# EAGLE design tube-tester (EAGLE 6.6.0)
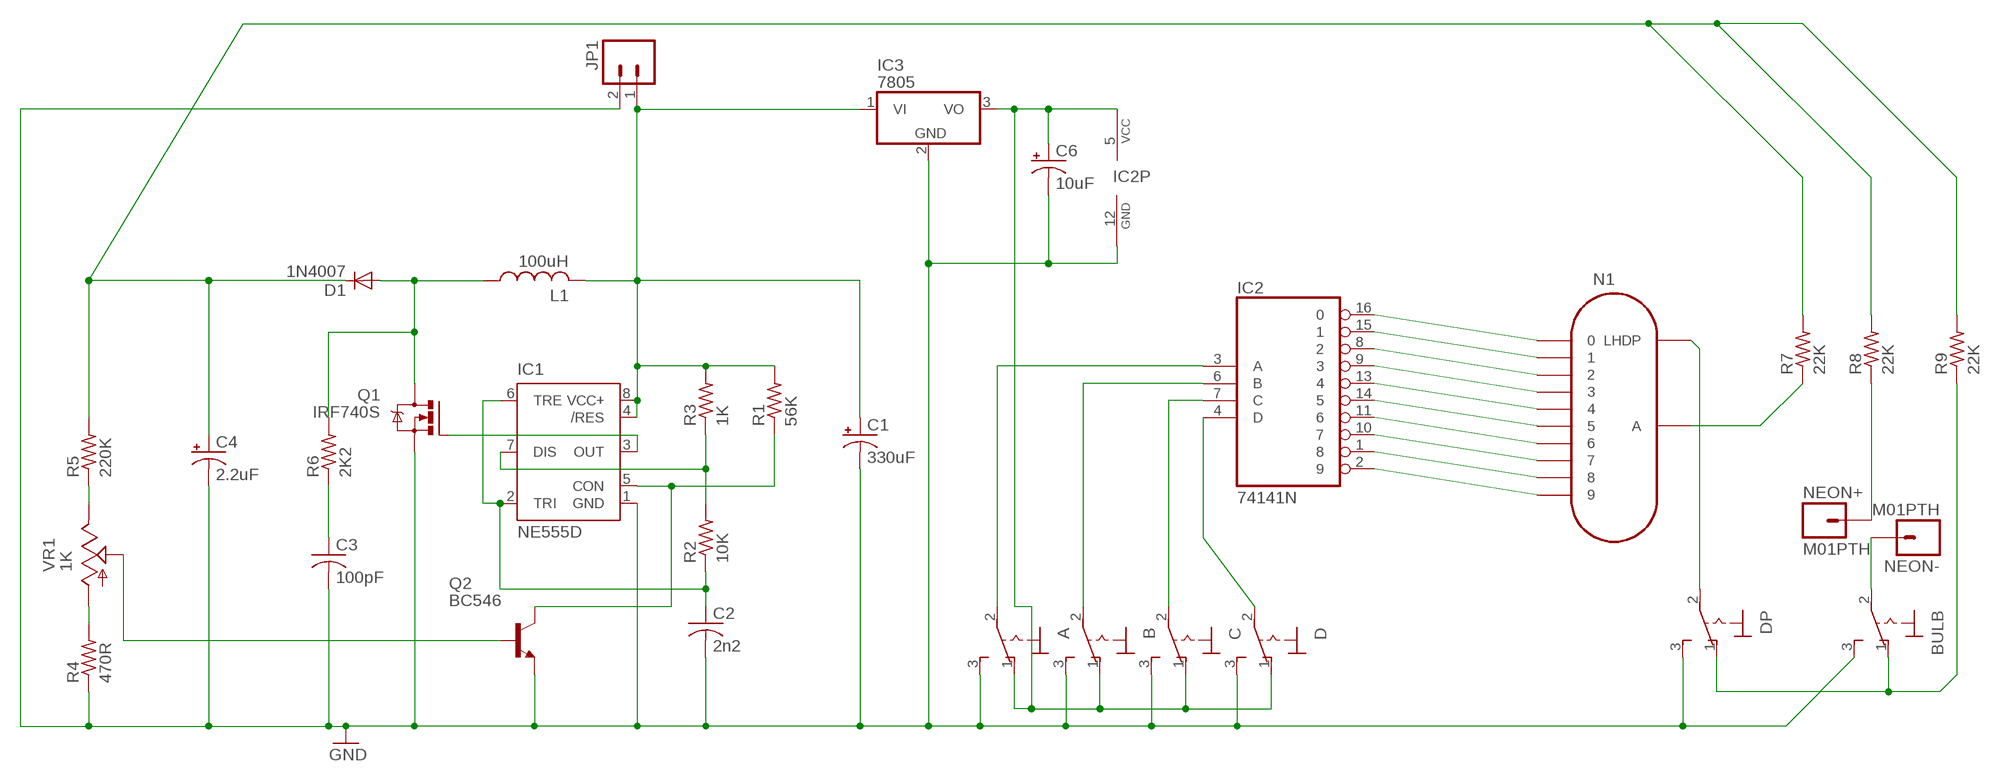
[diagram p0: schematic, sheet 1]

## Parts
A  320-916  [320-916]
B  320-916  [320-916]
BULB  320-916  [320-916]
C  320-916  [320-916]
C1  330uF  CAPACITOR_POLE5-10.5  [E5-10,5]
C2  2n2  CAPACITORC1206K  [C1206K]
C3  100pF  CAPACITORC1206K  [C1206K]
C4  2.2uF  CAPACITOR_POLE3.5-8  [E3,5-8]
C6  10uF  CAPACITOR_POLE2-5  [E2-5]
D  320-916  [320-916]
D1  1N4007  DIODESMA  [SMA-DIODE]
DP  320-916  [320-916]
IC1  NE555D  [SO08]
IC2  74141N  [DIL16]
IC3  7805  7805T  [TO220H]
JP1  M023.5MM  [SCREWTERMINAL-3.5MM-2]
L1  100uH  INDUCTOR0207/10  [0207/10]
N1  IN-12B  [IN-12]
NEON+  M01PTH  [1X01]
NEON-  M01PTH  [1X01]
Q1  IRF740S  [TO263]
Q2  BC546  BC546A  [TO92-EBC]
R1  56K  RESISTORR1206  [R1206]
R2  10K  RESISTORR1206  [R1206]
R3  1K  RESISTORR1206  [R1206]
R4  470R  RESISTOR0207/10  [0207/10]
R5  220K  RESISTOR0207/10  [0207/10]
R6  2K2  RESISTORR1206  [R1206]
R7  22K  RESISTOR0207/10  [0207/10]
R8  22K  RESISTOR0207/10  [0207/10]
R9  22K  RESISTOR0207/10  [0207/10]
VR1  1K  TRIM_POTCA6V  [CA6V]

## Nets
GND: A.3(S) B.3(S) BULB.3(S) C1.- C2.2 C3.2 C4.- C6.- C.3(S) D.3(S) DP.3(S) IC1.1(GND) IC2.12(GND) IC3.2(GND) JP1.2 Q1.2(S) Q2.E R4.1
N$1: IC1.3(OUT) Q1.1(G)
N$2: C3.1 R6.1
N$3: IC1.5(CON) Q2.C R1.1
N$4: IC1.7(DIS) R2.2 R3.1
N$5: C2.1 IC1.2(TRI) IC1.6(TRE) R2.1
N$6: D1.A L1.1 Q1.3(D) R6.2
N$7: C4.+ D1.C R5.2 R7.2 R8.2 R9.2
N$8: R5.1 VR1.E
N$9: R4.2 VR1.A
N$10: Q2.B VR1.S
N$11: IC2.15 N1.1
N$12: IC2.8 N1.2
N$13: IC2.9 N1.3
N$14: IC2.13 N1.4
N$15: IC2.14 N1.5
N$16: IC2.11 N1.6
N$17: IC2.10 N1.7
N$18: IC2.1 N1.8
N$19: IC2.2 N1.9
N$20: IC2.16 N1.0
N$21: N1.A R7.1
N$22: A.2(P) IC2.3(A)
N$23: B.2(P) IC2.6(B)
N$24: C.2(P) IC2.7(C)
N$25: D.2(P) IC2.4(D)
N$26: C1.+ IC1.4(/RES) IC1.8(VCC+) IC3.1(VI) JP1.1 L1.2 R1.2 R3.2
N$27: NEON+.1 R8.1
N$28: BULB.2(P) NEON-.1
N$29: A.1(O) B.1(O) C6.+ C.1(O) D.1(O) IC2.5(VCC) IC3.3(VO)
N$30: DP.2(P) N1.LHDP
N$32: BULB.1(O) DP.1(O) R9.1

## Library data of the parts
A B BULB C D DP = iStivi - Button-Switch:320-916: TOGGLE SWITCH distributor RS Components
C1 C4 C6 = iStivi - RCLD:CAPACITOR_POL: POLARIZED CAPACITOR, American symbol
C2 C3 = iStivi - RCLD:CAPACITOR: CAPACITOR, American symbol
D1 = iStivi - RCLD:DIODE: Diode These are standard reverse protection diodes and small signal diodes.
IC1 = iStivi - ICs:NE555: Timer General purpose bipolar Timer
IC2 = iStivi - ICs:74*141: Nixie Driver BCD to decimal decoder/driver
IC3 = iStivi - Transistor-FET-reg:78*: Positive VOLTAGE REGULATOR Source: http://cache.national.com/ds/LM/LM78L05.pdf http://www.fairchildsemi.com/ds/LM/LM7805.pdf
JP1 = iStivi - Header-Connector:M02: Header 2 Standard 2-pin 0.1" header. Use with straight break away headers (SKU : PRT-00116), right angle break away headers (PRT-00553), swiss pins (PRT-00743), machine pins (PRT-00117), and female headers (PRT-00115). Molex polarized connector foot print use with SKU : PRT-08233 with associated crimp pins and housings.
L1 = iStivi - RCLD:INDUCTOR: INDUCTOR
N1 = iStivi - Tubes:IN-12B: IN-12B: medium numeric topview nixie tube
NEON+ NEON- = iStivi - Header-Connector:M01: Header 1 Standard 1-pin 0.1" header. Use with straight break away headers (SKU : PRT-00116), right angle break away headers (PRT-00553), swiss pins (PRT-00743), machine pins (PRT-00117), and female headers (PRT-00115).
Q1 = iStivi - Transistor-FET:IRF740: N-CHANNEL MOS FET 400V MOSFET
Q2 = iStivi - Transistor-FET-reg:BC546*: NPN Transistor
R1-R9 = iStivi - RCLD:RESISTOR: RESISTOR
VR1 = iStivi - RCLD:TRIM_POT: POTENTIOMETER

## Board
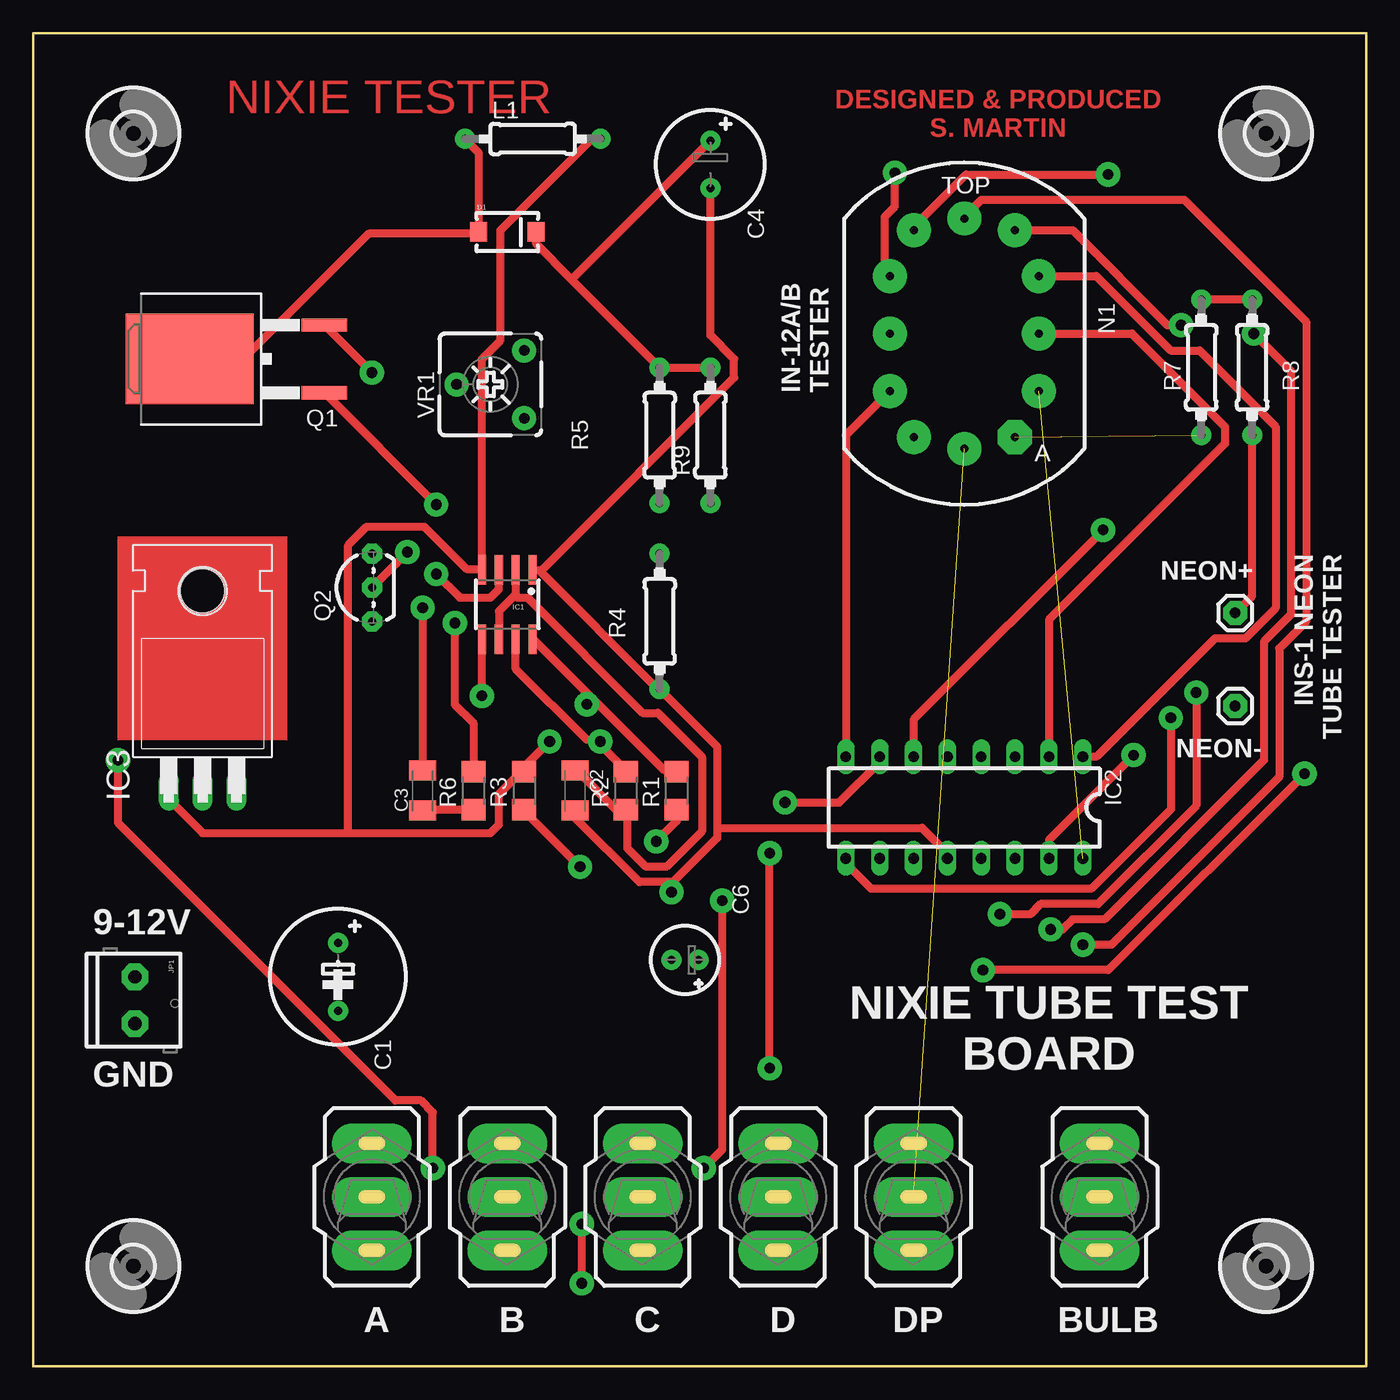
[diagram p1: board, top side]
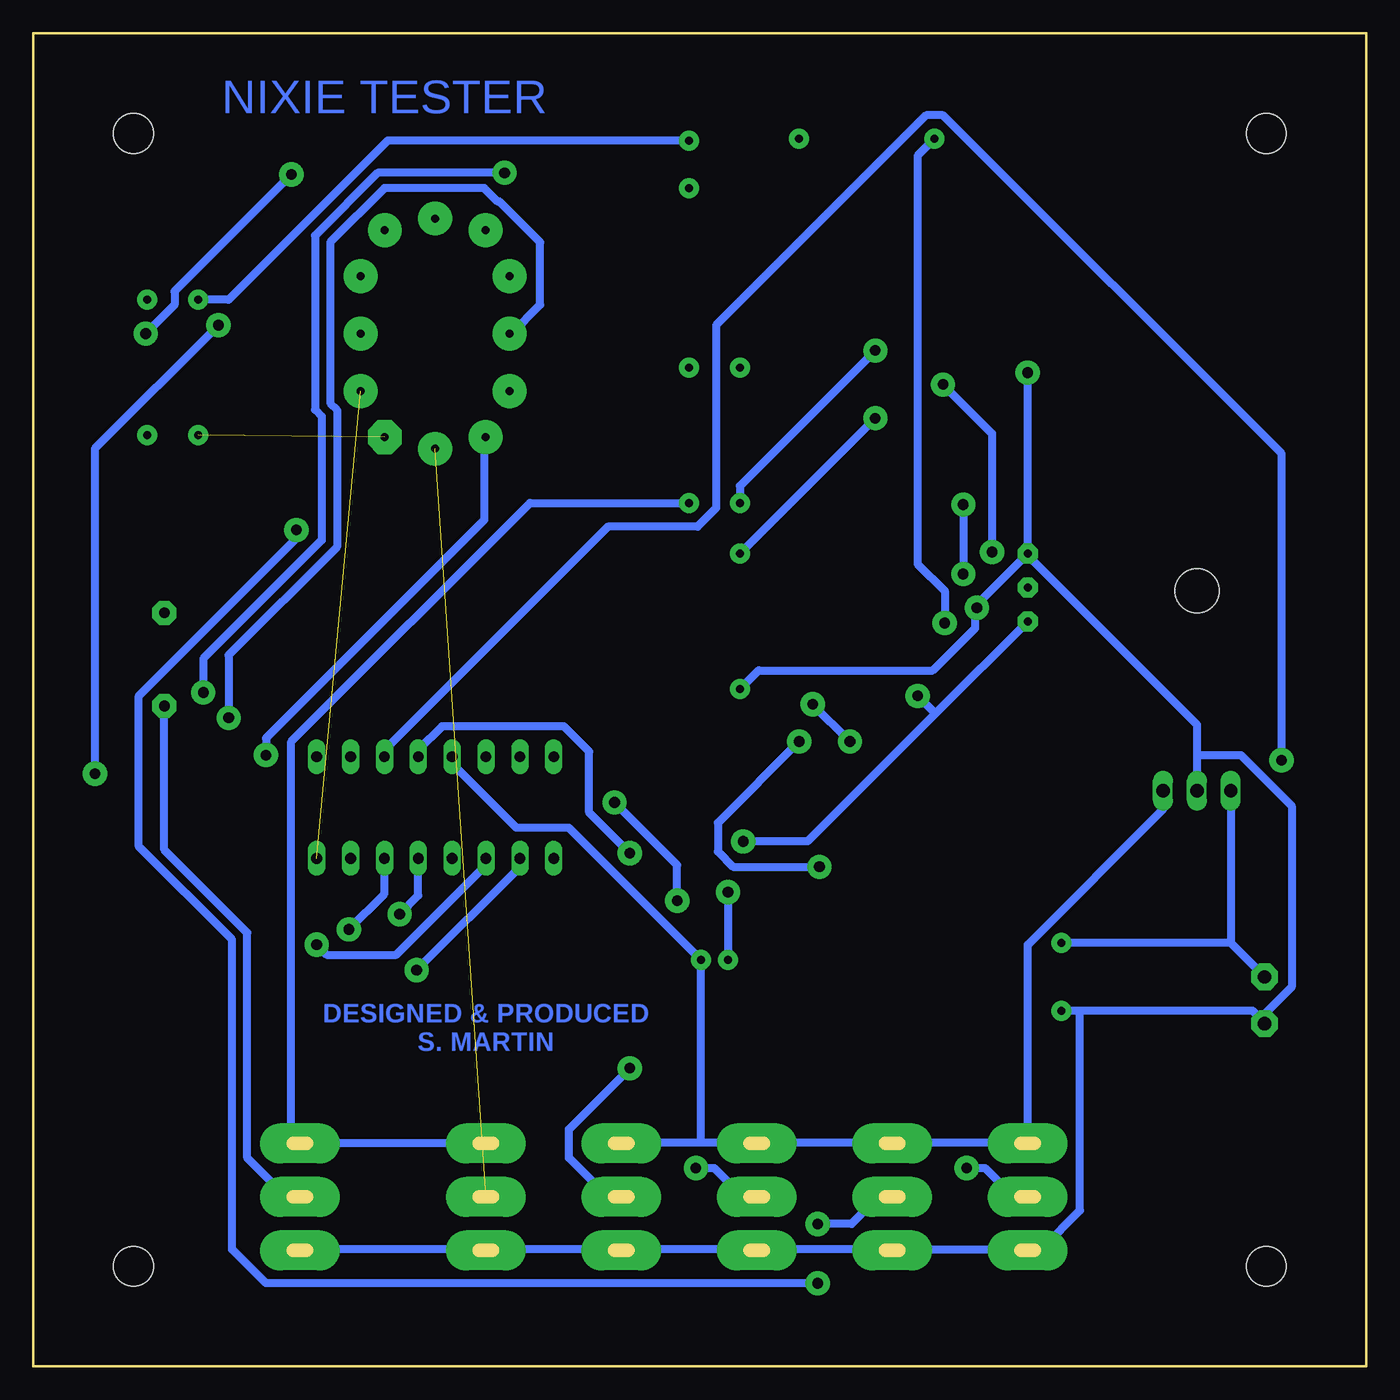
[diagram p2: board, bottom side, seen from below]

Size 100 x 100 mm. Coordinates in mm from the lower left corner, seen from the top.
Outline: 0,0 0,100 100,100 100,0 0,0
Copper layers (1*16): Top 0.035mm / dielectric 1.5mm / Bottom 0.035mm
Design rules "iStivi-0.8mm via-16mil-track *": minimum track width 24mil, minimum drill 0.8mm, track to track 20mil, track to pad 24mil, pad to pad 10mil, via to via 30mil, smd to smd 10mil, copper to edge 40mil, drill to drill 8mil, minimum pad ring 10mil, minimum via ring 20mil, stop-mask expansion 0mil, vias tented up to drill 0mil, thermal gap 12mil
tRestrict: area 5.1,24.8 to 10.2,30.5; area 21.9,30.8 to 23.8,32.7; area 21.9,25.7 to 23.8,27.6

### Footprints (pad centres in the part's own frame; a part is rotated, then mirrored left to right if it is on the bottom)
320-916 = drill 0.8 pad 3 long: 1 0,4.013; 2 0,0; 3 0,-4.013
E5-10,5 = drill 0.6 pad 1.5: + -2.54,0; - 2.54,0
C1206K = smd 1.5 x 2: 1 -1.5,0; 2 1.5,0
E3,5-8 = drill 0.6 pad 1.5: + -1.778,0; - 1.778,0
E2-5 = drill 0.6 pad 1.5: + -1.016,0; - 1.016,0
SMA-DIODE = smd 1.27 x 1.47: A -2.15,0; C 2.15,0
SO08 = smd 0.61 x 2.21: 1 -1.905,-2.616; 2 -0.635,-2.616; 3 0.635,-2.616; 4 1.905,-2.616; 5 1.905,2.616; 6 0.635,2.616; 7 -0.635,2.616; 8 -1.905,2.616
DIL16 = drill 0.8 long: 1 -8.89,-3.81; 2 -6.35,-3.81; 3 -3.81,-3.81; 4 -1.27,-3.81; 5 1.27,-3.81; 6 3.81,-3.81; 7 6.35,-3.81; 8 8.89,-3.81; 9 8.89,3.81; 10 6.35,3.81; 11 3.81,3.81; 12 1.27,3.81; 13 -1.27,3.81; 14 -3.81,3.81; 15 -6.35,3.81; 16 -8.89,3.81
TO220H = drill 1 long: 1 -2.54,-10.16; 2 0,-10.16; 3 2.54,-10.16 | hole 3.302: 0,4.826
SCREWTERMINAL-3.5MM-2 = drill 1 pad 2 octagon: 1 0,0; 2 3.5,0
0207/10 = drill 0.6 pad 1.5: 1 -5.08,0; 2 5.08,0
IN-12 = drill 0.6 pad 2.54: 0 5.59,-4.32; 1 -3.78,-7.766; 2 -5.59,-4.32; 3 -5.59,0; 4 -5.59,4.32; 5 -3.78,7.766; 6 0,8.64; 7 3.78,7.766; 8 5.59,4.32; 9 5.59,0; LHDP 0,-8.64 | drill 0.6 pad 2.54 octagon: A 3.78,-7.766
1X01 = drill 0.8 pad 1.8 octagon: 1 0,0
TO263 = smd 1 x 3.4: 1 -2.54,-6.6; 2 2.54,-6.6 | smd 6.8 x 9.6: 3 0,3.5
TO92-EBC = drill 0.6 pad 1.5 octagon: B 0,-1.27; C -2.54,-1.27; E 2.54,-1.27
R1206 = smd 1.6 x 1.803: 1 -1.422,0; 2 1.422,0
3,0 = hole 3: 0,0
CA6V = drill 0.8 pad 1.8: A -2.54,-2.54; E 2.54,-2.54; S 0,2.54

### Placement (x,y rotation side)
A  25.4,12.7 0 top
B  35.56,12.7 0 top
BULB  80.01,12.7 0 top
C  45.72,12.7 0 top
C1  22.86,29.21 270 top
C2  40.64,43.18 270 top
C3  29.21,43.18 90 top
C4  50.8,90.17 270 top
C6  48.9,30.48 180 top
D  55.88,12.7 0 top
D1  35.56,85.09 0 top
DP  66.04,12.7 0 top
IC1  35.56,57.15 180 top
IC2  69.85,41.91 180 top
IC3  12.7,53.34 0 top
JP1  7.62,29.21 270 top
L1  37.47,92.08 0 top
N1  69.85,77.47 0 top
NEON+  90.17,56.52 0 top
NEON-  90.17,49.53 0 top
Q1  15.24,75.56 90 top
Q2  24.13,58.42 90 top
R1  48.26,43.18 90 top
R2  44.45,43.18 90 top
R3  36.83,43.18 90 top
R4  46.99,55.88 90 top
R5  46.99,69.85 90 top
R6  33.02,43.18 90 top
R7  87.63,74.93 90 top
R8  91.44,74.93 90 top
R9  50.8,69.85 90 top
U$1  [3,0]  7.5,7.5 0 top
U$2  [3,0]  92.5,7.5 0 top
U$3  [3,0]  92.5,92.5 0 top
U$4  [3,0]  7.5,92.5 0 top
VR1  34.29,73.66 90 top

### Tracks (layer width: path | path; a pad name or v marks a point on that pad's centre or on a via)
GND  (via drill 0.8)
  Top 0.61: v29.21,56.9 C3.2 | v25.4,74.55 Q1.2 | C2.2 40.64,41.15 45.47,36.32 47.88,36.32 | 47.88,36.32 48.01,36.32 51.31,39.62 51.31,40.39 | 51.31,40.39 51.31,46.48 R4.1 46.74,50.93 37.97,59.69 | 37.97,59.69 37.47,59.69 IC1.1 | IC2.12 68.58,38.48 66.67,40.39 51.31,40.39 | 47.88,36.32 v47.88,35.56 | C4.- 50.8,77.34 52.58,75.56 52.58,74.17 38.23,59.82 37.97,59.69
  Bottom 0.61: 21.46,26.67 8.51,26.67 7.62,25.78 JP1.2 7.75,26.29 5.59,28.45 5.59,42.04 9.4,45.85 12.7,45.85 | 21.46,26.67 C1.- | BULB.3 80.01,8.76 66.29,8.76 DP.3 66.04,8.76 56.13,8.76 D.3 55.88,8.76 45.97,8.76 C.3 45.72,8.76 35.81,8.76 B.3 35.56,8.76 25.4,8.76 A.3 25.15,8.89 24.26,8.89 21.46,11.68 21.46,26.67 | Q2.E 29.21,57.15 v29.21,56.9 29.34,56.64 29.34,55.37 32.51,52.2 45.59,52.2 R4.1 | 12.7,45.85 12.7,48.13 25.27,60.71 Q2.E | 12.7,45.85 IC3.2 | Q2.E v25.4,74.55 | v47.88,35.56 C6.-
N$1  (via drill 0.8)
  Top 0.61: IC1.3 34.92,58.29 34.29,57.66 32,57.66 v30.23,59.44 | v30.23,64.64 Q1.1
  Bottom 0.61: v30.23,64.64 v30.23,59.44
N$2
  Top 0.61: R6.1 33.02,41.78 29.21,41.78 C3.1
N$3  (via drill 0.8)
  Top 0.61: R1.1 48.26,40.89 v46.74,39.37 | v33.66,50.29 IC1.5
  Bottom 0.61: v46.74,39.37 41.91,39.37 32.32,48.96 | Q2.C 32.32,48.96 | 32.32,48.96 v33.66,50.29
N$4  (via drill 0.8)
  Top 0.61: v41.02,37.47 36.83,41.66 R3.1 | R2.2 44.45,44.7 42.55,46.61 v42.55,46.86 42.29,46.99 41.53,46.99 36.2,52.32 IC1.7
  Bottom 0.61: v41.02,37.47 47.5,37.47 48.64,38.61 48.64,40.77 v42.55,46.86
N$5
  Top 0.61: C2.1 40.64,44.58 40.89,44.58 43.69,41.78 44.45,41.78 R2.1 44.58,41.53 44.58,38.86 45.97,37.47 47.5,37.47 50.16,40.13 50.16,45.72 46.86,49.02 45.72,49.02 37.08,57.66 36.32,57.66 36.13,57.85 | IC1.6 34.92,56.64 36.13,57.85 | 36.13,57.85 36.2,57.91 IC1.2
N$6  (via drill 0.8)
  Top 0.61: L1.1 33.4,91.06 D1.A 33.15,84.96 25.15,84.96 15.75,75.56 Q1.3 | R6.2 33.02,48.26 31.62,49.66 v31.62,55.75
  Bottom 0.61: v31.62,55.75 31.62,58.17 33.66,60.2 33.66,90.81 L1.1
N$7
  Top 0.61: R8.2 R7.2 | 40.39,81.53 R5.2 R9.2 | 40.39,81.53 37.72,84.2 D1.C | 40.39,81.53 C4.+
  Bottom 0.61: R7.2 85.34,80.01 73.41,91.95 C4.+
N$8
  Bottom 0.61: R5.1 46.99,66.04 VR1.E
N$9
  Bottom 0.61: VR1.A R4.2
N$10  (via drill 0.8)
  Top 0.61: v28.07,61.09 Q2.B
  Bottom 0.61: v28.07,61.09 28.07,69.98 VR1.S
N$11  (via drill 0.8)
  Top 0.61: IC2.15 76.2,39.5 v82.55,45.85
  Bottom 0.61: v82.55,45.85 82.55,47.12 66.17,63.5 66.17,69.6 N1.1
N$12
  Top 0.61: IC2.8 60.96,69.85 N1.2
N$13  (via drill 0.8)
  Top 0.61: IC2.9 60.96,37.72 62.87,35.81 79.38,35.81 85.34,41.78 v85.34,48.64
  Bottom 0.61: v85.34,48.64 85.34,53.34 77.22,61.47 77.22,71.75 77.72,72.26 77.72,84.33 73.66,88.39 66.17,88.39 65.15,87.38 65.02,87.38 61.98,84.33 61.98,79.63 64.14,77.47 N1.3
N$14  (via drill 0.8)
  Top 0.61: v72.52,33.91 74.8,33.91 75.56,34.67 79.88,34.67 87.25,42.04 v87.25,50.55 | v64.64,89.53 64.64,87 63.88,86.23 63.88,82.17 N1.4
  Bottom 0.61: IC2.13 71.12,35.31 v72.52,33.91 | v87.25,50.55 87.25,53.09 78.36,61.98 78.36,71.25 78.87,71.75 78.87,84.84 74.17,89.53 v64.64,89.53
N$15  (via drill 0.8)
  Top 0.61: v76.33,32.77 77.22,32.77 77.98,33.53 80.39,33.53 92.33,45.47 92.33,54.36 94.36,56.39 94.36,74.68 v91.57,77.47 | v80.64,89.41 69.98,89.41 66.17,85.6 66.17,85.34 N1.5
  Bottom 0.61: IC2.14 73.66,35.43 v76.33,32.77 | v91.57,77.47 89.41,79.63 89.41,80.64 v80.64,89.41
N$16  (via drill 0.8)
  Top 0.61: v78.74,31.62 80.9,31.62 93.47,44.2 93.47,53.85 95.5,55.88 95.5,78.36 86.36,87.5 71.12,87.5 69.85,86.23 N1.6
  Bottom 0.61: IC2.11 66.04,37.59 72.77,30.86 77.98,30.86 v78.74,31.62
N$17  (via drill 0.8)
  Top 0.61: v71.25,29.72 80.64,29.72 v95.38,44.45 | v86.11,78.11 85.09,78.11 77.98,85.22 73.66,85.22 N1.7
  Bottom 0.61: IC2.10 63.5,37.47 v71.25,29.72 | v95.38,44.45 95.38,68.83 v86.11,78.11
N$18
  Top 0.61: IC2.1 79.76,45.72 88.65,54.61 90.93,54.61 93.22,56.9 93.22,70.48 87.5,76.2 85.34,76.2 79.76,81.79 75.56,81.79 N1.8
N$19
  Top 0.61: IC2.2 76.2,56.01 89.41,69.22 89.41,70.48 82.42,77.47 N1.9
N$20  (1 unrouted)
N$21  (1 unrouted)
N$22  (via drill 0.8)
  Top 0.61: v6.35,45.47 6.35,40.77 27.18,19.94 29.08,19.94 29.97,19.05 v29.97,14.86
  Bottom 0.61: IC2.3 73.66,46.23 56.9,62.99 50.16,62.99 48.77,64.39 48.77,78.11 33.02,93.85 31.75,93.85 6.35,68.45 v6.35,45.47 | v29.97,14.86 28.57,14.86 26.42,12.7 A.2
N$23  (via drill 0.8)
  Top 0.61: IC2.6 66.04,48.51 v80.26,62.74 | v41.15,10.67 v41.15,6.22
  Bottom 0.61: v80.26,62.74 80.26,62.1 92.08,50.29 92.08,38.99 85.09,32 85.09,8.76 82.55,6.22 v41.15,6.22 | v41.15,10.67 38.61,10.67 36.58,12.7 B.2
N$24  (via drill 0.8)
  Top 0.61: IC2.7 63.5,45.34 60.45,42.29 v56.39,42.29 | v51.69,34.92 51.69,16.26 v50.29,14.86
  Bottom 0.61: v56.39,42.29 51.69,37.59 v51.69,34.92 | v50.29,14.86 48.9,14.86 46.74,12.7 C.2
N$25  (via drill 0.8)
  Top 0.61: v55.24,22.35 v55.24,38.48
  Bottom 0.61: IC2.4 71.12,46.23 69.34,48.01 60.2,48.01 58.29,46.1 58.29,41.53 v55.24,38.48 | v55.24,22.35 59.82,17.78 59.82,15.62 56.9,12.7 D.2
N$26  (via drill 0.8)
  Top 0.61: 41.97,50.1 37.47,54.61 IC1.8 | 41.97,50.1 47.37,44.7 48.26,44.7 R1.2 | 23.62,40.01 12.7,40.01 10.16,42.55 IC3.1 | 23.62,40.01 34.29,40.01 34.92,40.64 34.92,42.93 36.58,44.58 36.83,44.58 R3.2 36.7,44.83 v38.73,46.86 | 23.62,40.01 23.62,61.59 25.02,62.99 29.34,62.99 32.51,59.82 33.66,59.82 IC1.4 33.66,75.56 35.05,76.96 35.05,85.22 41.91,92.08 L1.2 | v41.53,49.66 41.97,50.1
  Bottom 0.61: 10.16,31.75 C1.+ | JP1.1 10.16,31.75 | v38.73,46.86 v41.53,49.66 | IC3.1 10.16,31.75
N$27
  Top 0.61: R8.1 91.44,57.78 NEON+.1
N$28
  Bottom 0.61: NEON-.1 90.17,38.73 83.95,32.51 83.95,15.62 81.03,12.7 BULB.2
N$29
  Bottom 0.61: IC2.5 68.58,45.21 63.75,40.39 59.82,40.39 C6.+ 49.91,16.76 | IC3.3 15.24,41.78 25.4,31.62 A.1 25.65,16.76 35.56,16.76 B.1 35.81,16.76 45.72,16.76 C.1 45.97,16.76 49.91,16.76 | 49.91,16.76 55.88,16.76 D.1
N$30  (1 unrouted)
N$32
  Bottom 0.61: R9.1 62.74,64.77 80.64,46.86 80.64,17.4 80.01,16.76 BULB.1 79.76,16.76 66.04,16.76 DP.1
(copper drawn outside any net)
  shapes: Top area x1

### Text on the board
Top: NIXIE TESTER | DESIGNED & PRODUCED / S. MARTIN
Bottom: NIXIE TESTER | DESIGNED & PRODUCED / S. MARTIN
tSilk: IN-12A/B / TESTER | INS-1 NEON / TUBE TESTER | 9-12V | NIXIE TUBE TEST / BOARD | GND
_tplace: TOP | A
_tValues: 2.2uF | 220K | 22K | 22K | 470R | M01PTH | 330uF | 100uF | M01PTH | 10uF